# EasyEDA Pro project ZYNQ7020核心板-双DDR-V2.1.epro, board zynq核心板2312_2
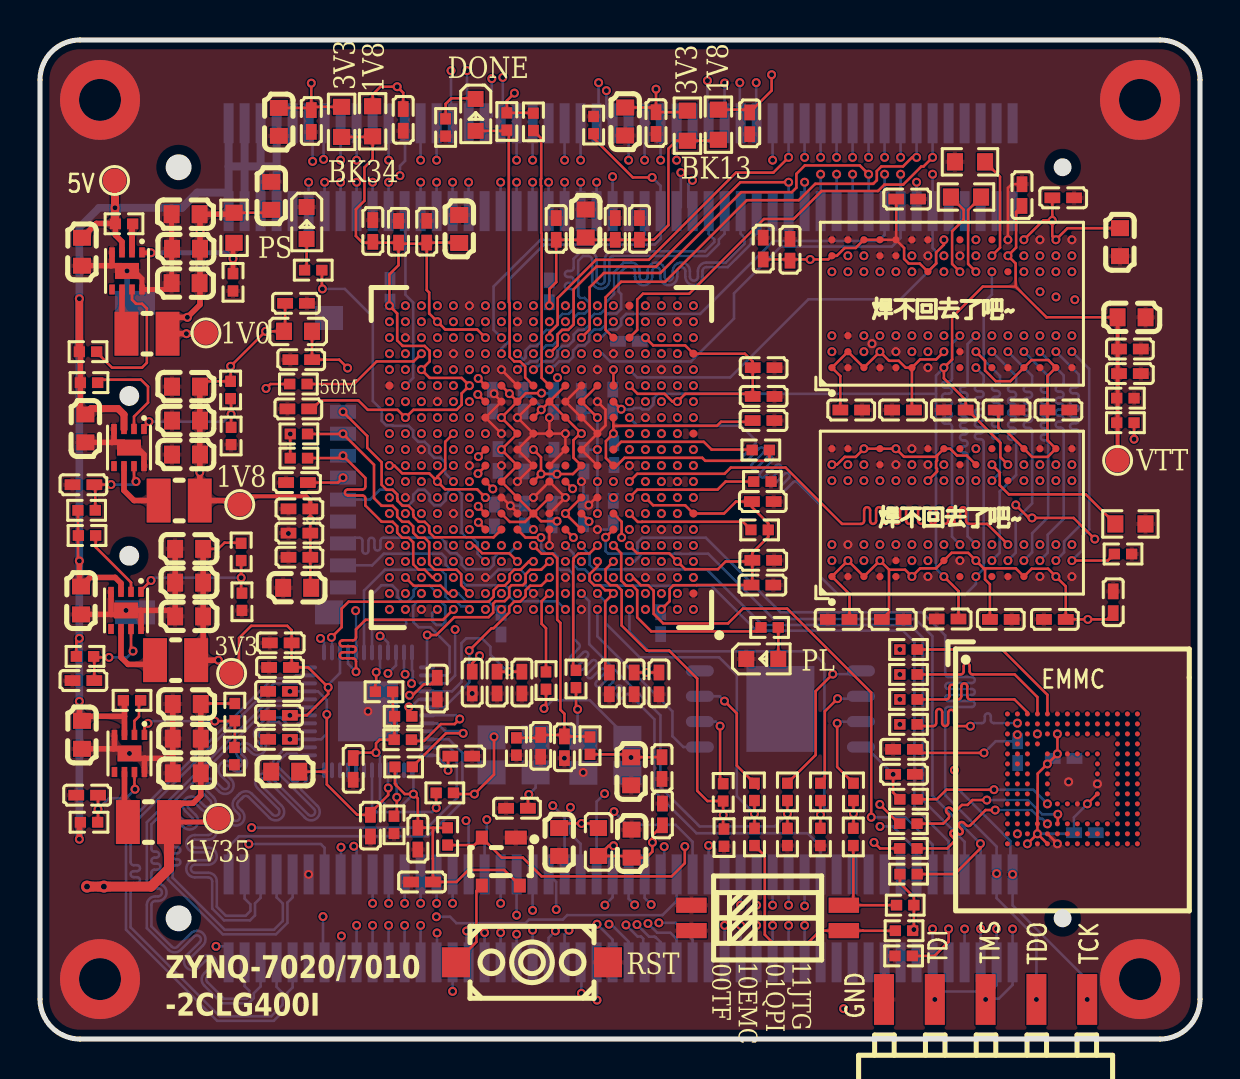
[diagram p10: board, top side]
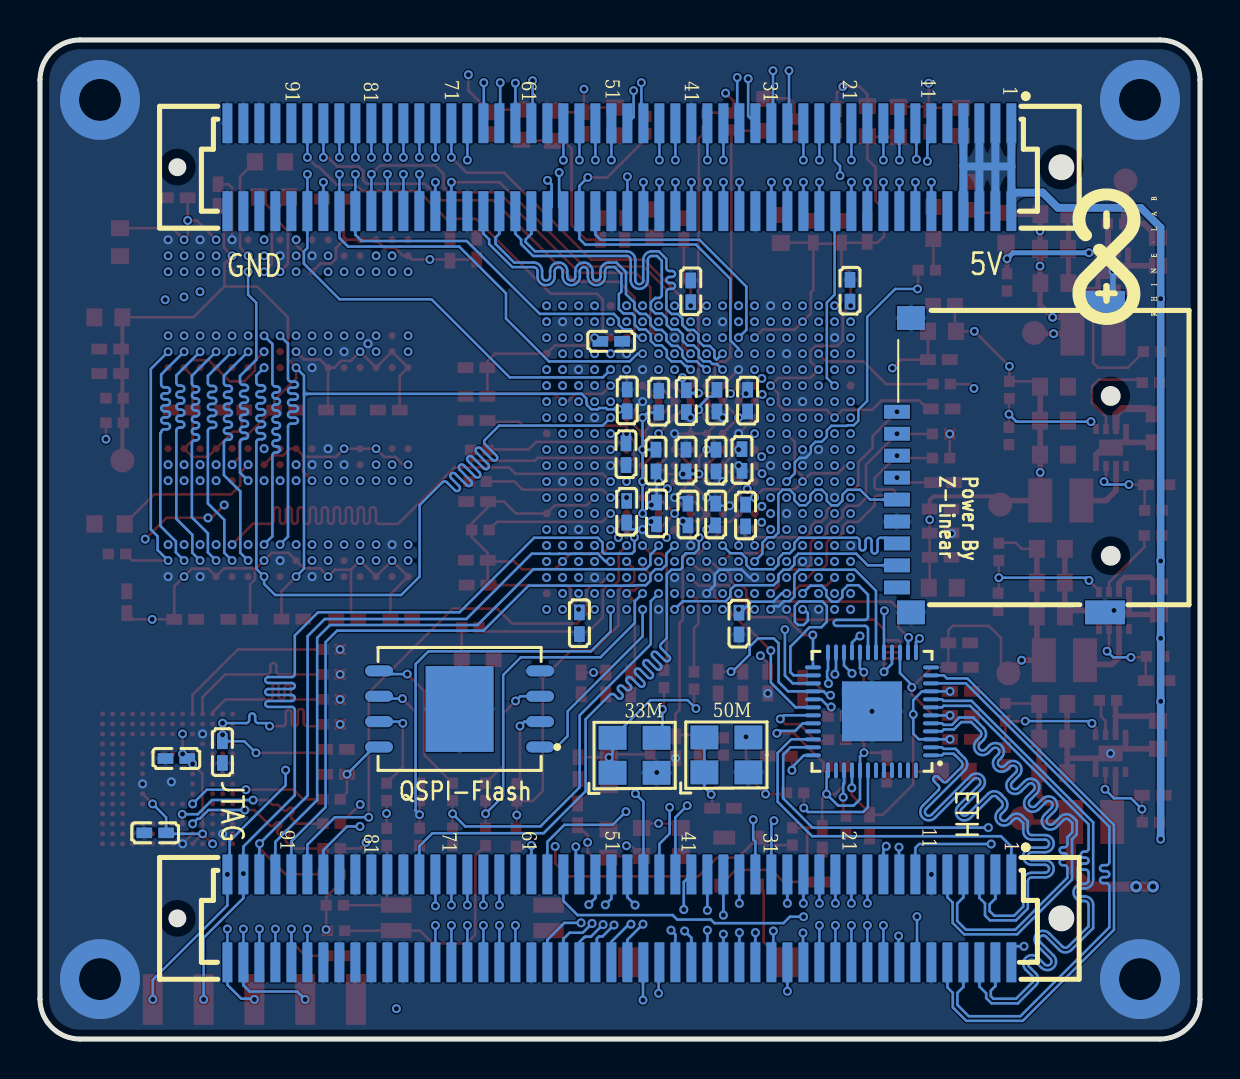
[diagram p11: board, bottom side, seen from below]

Outline 58 x 50 mm; copper layers: Top Layer, S1, S2, S3, S4, Bottom Layer. Coordinates in mm from the lower left corner of the outline.
Outline path: 0,48 0,2 arc(0.59,0.59) 2,0 56,0 arc(57.41,0.59) 58,2 58,48 arc(57.41,49.41) 56,50 2,50 arc(0.59,49.41) 0,48
Stack: Top Layer 0.035mm 外层铜厚1oz / Dielectric1 0.0994mm 3313 RC57% 4.2mil / S1 0.035mm / Dielectric2 0.55mm 0.55mm H/H No copper / S2 0.035mm / Dielectric3 0.1088mm 2116 RC54% 4.9mil / S3 0.035mm / Dielectric4 0.55mm 0.55mm H/H No copper / S4 0.035mm / Dielectric5 0.0994mm 3313 RC57% 4.2mil / Bottom Layer 0.035mm 外层铜厚1oz

## Design rules (mm)
net PHY_MDI3_N: PHY_MDI3
net PHY_MDI1_N: PHY_MDI1
net PHY_MDI3_P: PHY_MDI3
net PHY_MDI1_P: PHY_MDI1
net PHY_MDI2_N: PHY_MDI2
net PHY_MDI0_N: PHY_MDI0
net PHY_MDI2_P: PHY_MDI2
net PHY_MDI0_P: PHY_MDI0
net BK34_L1_N--T10: DP13
net BK34_L1_P--T11: DP13
net BK34_L2_P--T12: DP12
net BK34_L2_N--U12: DP12
net BK34_L6_P--P14: DP11
net BK34_L6_N--R14: DP11
net BK34_L4_P--V12: DP23
net BK34_L4_N--W13: DP23
net BK34_L8_P--W14: DP22
net BK34_L8_N--Y14: DP22
net BK34_L11_P--U14: DP9
net BK34_L10_P--V15: DP21
net BK34_L11_N--U15: DP9
net BK34_L10_N--W15: DP21
net BK34_L5_P--T14: DP8
net BK34_L18_P--V16: DP20
net BK34_L5_N--T15: DP8
net BK34_L18_N--W16: DP20
net BK34_L9_P--T16: DP6
net BK34_L9_N--U17: DP6
net BK34_L7_N--Y17: DP19
net BK34_L20_P--T17: DP7
net BK34_L7_P--Y16: DP19
net BK34_L20_N--R18: DP7
net BK34_L21_P--V17: DP18
net BK34_L21_N--V18: DP18
net BK34_L24_P--P15: DP5
net BK34_L17_P--Y18: DP17
net BK34_L24_N--P16: DP5
net BK34_L17_N--Y19: DP17
net BK34_L19_P--R16: DP4
net BK34_L22_P--W18: DP16
net BK34_L19_N--R17: DP4
net BK34_L22_N--W19: DP16
net BK34_L16_N--W20: DP15
net BK34_L23_N--P18: DP3
net BK34_L16_P--V20: DP15
net BK34_L23_P--N17: DP3
net BK34_L13_N--P19: DP24
net BK34_L13_P--N18: DP24
net BK34_L14_N--P20: DP1
net BK34_L15_P--T20: DP14
net BK34_L14_P--N20: DP1
net BK34_L15_N--U20: DP14
net DDR3_CLK_P: DDR3_CLK
net DDR3_CLK_N: DDR3_CLK
net DDR3_DQS0_P: DDR3_DQS0
net DDR3_DQS0_N: DDR3_DQS0
net DDR3_DQS1_N: DDR3_DQS1
net DDR3_DQS1_P: DDR3_DQS1
net DDR3_DQS2_P: DDR3_DQS2
net DDR3_DQS2_N: DDR3_DQS2
net DDR3_DQS3_N: DDR3_DQS3
net DDR3_DQS3_P: DDR3_DQS3
template: 用户自定义配置
spacing safeClearance (default): track to track 0.099, other pairs 0.099 to 0.3
track width trackWidth (default): min 0.13, default 0.13, max 1.001
differential pair differentialPair (default): width min 0.13, default 0.13, max 2.54; gap min 0.099, default 0.099
via viaSize (default): diameter min 0.45, default 0.45, max 10; hole min 0.201, default 0.201, max 5.999
net BK34_L1_N--T10 uses 数据等长
net BK34_L1_P--T11 uses 数据等长
net BK34_L2_P--T12 uses 数据等长
net BK34_L2_N--U12 uses 数据等长
net BK34_L6_P--P14 uses 数据等长
net BK34_L6_N--R14 uses 数据等长
net BK34_L4_P--V12 uses 数据等长
net BK34_L4_N--W13 uses 数据等长
net BK34_L8_P--W14 uses 数据等长
net BK34_L8_N--Y14 uses 数据等长
net BK34_L11_P--U14 uses 数据等长
net BK34_L10_P--V15 uses 数据等长
net BK34_L11_N--U15 uses 数据等长
net BK34_L10_N--W15 uses 数据等长
net BK34_L5_P--T14 uses 数据等长
net BK34_L18_P--V16 uses 数据等长
net BK34_L5_N--T15 uses 数据等长
net BK34_L18_N--W16 uses 数据等长
net BK34_L9_P--T16 uses 数据等长
net BK34_L9_N--U17 uses 数据等长
net BK34_L7_N--Y17 uses 数据等长
net BK34_L20_P--T17 uses 数据等长
net BK34_L7_P--Y16 uses 数据等长
net BK34_L20_N--R18 uses 数据等长
net BK34_L21_P--V17 uses 数据等长
net BK34_L21_N--V18 uses 数据等长
net BK34_L24_P--P15 uses 数据等长
net BK34_L17_P--Y18 uses 数据等长
net BK34_L24_N--P16 uses 数据等长
net BK34_L17_N--Y19 uses 数据等长
net BK34_L19_P--R16 uses 数据等长
net BK34_L22_P--W18 uses 数据等长
net BK34_L19_N--R17 uses 数据等长
net BK34_L22_N--W19 uses 数据等长
net BK34_L16_N--W20 uses 数据等长
net BK34_L23_N--P18 uses 数据等长
net BK34_L16_P--V20 uses 数据等长
net BK34_L23_P--N17 uses 数据等长
net BK34_L13_N--P19 uses 数据等长
net BK34_L13_P--N18 uses 数据等长
net BK34_L14_N--P20 uses 数据等长
net BK34_L15_P--T20 uses 数据等长
net BK34_L14_P--N20 uses 数据等长
net BK34_L15_N--U20 uses 数据等长
net DDR3_A0 uses 地址等长
net DDR3_A1 uses 地址等长
net DDR3_A2 uses 地址等长
net DDR3_A3 uses 地址等长
net DDR3_A4 uses 地址等长
net DDR3_A5 uses 地址等长
net DDR3_A6 uses 地址等长
net DDR3_A7 uses 地址等长
net DDR3_A8 uses 地址等长
net DDR3_A9 uses 地址等长
net DDR3_A10 uses 地址等长
net DDR3_A11 uses 地址等长
net DDR3_A12 uses 地址等长
net DDR3_A13 uses 地址等长
net DDR3_A14 uses 地址等长
net DDR3_BA0 uses 地址等长
net DDR3_BA1 uses 地址等长
net DDR3_BA2 uses 地址等长
net DDR3_CKE uses 地址等长
net DDR3_S0 uses 地址等长
net DDR3_RAS uses 地址等长
net DDR3_CAS uses 地址等长
net DDR3_WE uses 地址等长
net DDR3_ODT uses 地址等长
net DDR3_DM0 uses 数据等长
net DDR3_D2 uses 数据等长
net DDR3_D3 uses 数据等长
net DDR3_D6 uses 数据等长
net DDR3_D5 uses 数据等长
net DDR3_D7 uses 数据等长
net DDR3_DM1 uses 数据等长
net DDR3_D14 uses 数据等长
net DDR3_D15 uses 数据等长
net DDR3_D1 uses 数据等长
net DDR3_D0 uses 数据等长
net DDR3_D4 uses 数据等长
net DDR3_D8 uses 数据等长
net DDR3_D9 uses 数据等长
net DDR3_D10 uses 数据等长
net DDR3_D13 uses 数据等长
net DDR3_D11 uses 数据等长
net DDR3_D12 uses 数据等长
net DDR3_CLK_P uses ddr_clk
net DDR3_CLK_N uses ddr_clk
net DDR3_D18 uses 数据等长
net DDR3_D17 uses 数据等长
net DDR3_D16 uses 数据等长
net DDR3_D19 uses 数据等长
net DDR3_DM2 uses 数据等长
net DDR3_D20 uses 数据等长
net DDR3_D24 uses 数据等长
net DDR3_D26 uses 数据等长
net DDR3_DM3 uses 数据等长
net DDR3_D28 uses 数据等长
net DDR3_D25 uses 数据等长
net DDR3_D27 uses 数据等长
net DDR3_D29 uses 数据等长
net DDR3_D30 uses 数据等长
net DDR3_D31 uses 数据等长
net DDR3_D22 uses 数据等长
net DDR3_D23 uses 数据等长
net DDR3_D21 uses 数据等长
net DDR3_DQS0_P uses 数据等长
net DDR3_DQS0_N uses 数据等长
net DDR3_DQS1_N uses 数据等长
net DDR3_DQS1_P uses 数据等长
net DDR3_DQS2_P uses 数据等长
net DDR3_DQS2_N uses 数据等长
net DDR3_DQS3_N uses 数据等长
net DDR3_DQS3_P uses 数据等长

## Placement (name value [footprint] x y rotation side)
1V  -  [测试点]  8.3 35.34 0 top
1V8  -  [测试点]  9.99 26.75 0 top
1V35  -  [测试点]  8.92 11.04 180 top
3V3  -  [测试点]  9.58 18.3 0 top
5V  -  [测试点]  3.73 42.97 0 top
C1  22uF  [C0603]  7.28 41.28 0 top
C2  22uF  [C0603]  7.3 39.55 0 top
C3  22uF  [C0603]  7.28 37.83 0 top
C4  22uF  [C0603]  2.27 30.56 90 top
C5  22uF  [C0603]  7.3 32.65 0 top
C6  22uF  [C0603]  7.3 30.95 0 top
C7  22uF  [C0603]  7.3 29.25 0 top
C8  22uF  [C0603]  2.1 15.23 90 top
C9  22uF  [C0603]  7.34 16.77 0 top
C10  22uF  [C0603]  7.34 13.3 0 top
C11  22uF  [C0603]  7.34 15.03 0 top
C14  22uF  [C0603]  2.05 21.95 90 top
C15  22uF  [C0603]  7.46 24.53 0 top
C16  22uF  [C0603]  7.46 21.15 0 top
C17  22uF  [C0603]  7.46 22.84 0 top
C20  100nF  [C0402]  40.56 31.48 0 top
C22  100nF  [C0402]  43.15 31.48 180 top
C24  100nF  [C0402]  48.33 31.48 0 top
C26  100nF  [C0402]  50.92 31.48 0 top
C27  100nF  [C0402]  51.16 42.1 0 top
C28  100nF  [C0402]  37.5 39.5 90 top
C40  100nF  [C0402]  42.63 21 0 top
C42  100nF  [C0402]  53.66 21.86 90 top
C44  100nF  [C0402]  50.74 21 180 top
C45  100nF  [C0402]  43.36 42.04 0 top
C46  100nF  [C0402]  48.04 21 0 top
C47  100nF  [C0402]  36.16 39.56 90 top
C48  100nF  [C0402]  39.93 21 180 top
C65  100nF  [C0402]  25.03 14.67 270 top
C71  100nF  [C0402]  43.2 13.25 0 top
C74  100nF  [C0402]  45.38 21.02 180 top
C75  100nF  [C0402]  45.74 31.48 180 top
C76  100nF  [C0402]  49.1 42.24 90 top
C78  10uF  [C0402]  54.49 34.53 180 top
C79  100nF  [C0402]  31.12 11.24 90 top
C80  100nF  [C0402]  13.06 34 0 top
C81  100nF  [C0402_NEW]  27.17 26.31 270 bottom
C83  22uF  [C0603]  25.96 9.86 90 top
C84  100nF  [C0402_NEW]  25.81 40.54 90 top
C85  100nF  [C0402_NEW]  28.76 40.54 90 top
C86  100nF  [C0402_NEW]  25.46 37.42 90 bottom
C87  100nF  [C0402_NEW]  29.97 40.54 90 top
C89  100nF  [C0402]  16.52 10.68 270 top
C90  100nF  [C0402]  11.95 17.4 180 top
C91  100nF  [C0402]  28.46 17.8 90 top
C92  100nF  [C0402]  28.7 29.27 90 bottom
C93  100nF  [C0402]  26.22 14.6 270 top
C94  100nF  [C0402]  19.34 40.4 270 top
C95  100nF  [C0402]  19.1 7.86 0 top
C97  100nF  [C0402]  51.18 14.04 0 bottom
C99  100nF  [C0402]  52.24 10.32 0 bottom
C102  100nF  [C0402]  21.06 14.16 0 top
C104  100nF  [C0402_NEW]  17.93 40.4 90 top
C105  100nF  [C0402_NEW]  23.85 11.55 180 top
C106  22uF  [C0603]  2.1 39.4 90 top
C108  100nF  [C0402]  48.88 14.36 270 bottom
C109  1uF  [C0402]  43.2 14.5 0 top
C110  100nF  [C0402]  2.36 12.2 0 top
C111  10nF  [C0402]  2.17 27.74 0 top
C112  100nF  [C0402_NEW]  16.64 40.44 90 top
C113  100nF  [C0402]  11.95 15 180 top
C114  220nF  [C0402]  2.17 17.94 0 top
C115  10uF  [C0402]  54.49 33.3 180 top
C117  100nF  [C0402_NEW]  17.5 37.45 90 bottom
C118  100nF  [C0402_NEW]  12.91 31.53 180 top
C119  100nF  [c0402_new]  21.61 17.84 270 top
C120  100nF  [C0402_NEW]  12.85 27.85 180 top
C122  100nF  [C0402_NEW]  23.05 20.79 270 bottom
C123  100nF  [C0402_NEW]  31.1 13.56 270 top
C124  100nF  [C0402_NEW]  22.72 26.2 270 bottom
C130  100nF  [C0402_NEW]  29.44 34.92 180 bottom
C131  100nF  [C0402_NEW]  31.03 20.81 270 bottom
C132  100nF  [C0402_NEW]  36.12 22.72 0 top
C133  100nF  [C0402_NEW]  36.18 32.16 0 top
C134  100nF  [C0402_NEW]  36.18 33.6 0 top
C137  100nF  [C0402_NEW]  36.16 23.96 0 top
C140  100nF  [C0402_NEW]  36.14 26.9 0 top
C143  100nF  [C0402_NEW]  30.8 45.84 270 top
C144  100nF  [C0402_NEW]  28.66 26.39 270 bottom
C145  100nF  [C0402_NEW]  28.64 31.96 90 bottom
C146  1uF  [C0402]  13.56 45.94 90 top
C147  100nF  [C0402_NEW]  12.97 26.53 180 top
C148  100nF  [C0402_NEW]  12.8 36.82 0 top
C150  100nF  [C0402_NEW]  12.97 25.32 180 top
C157  22uF  [C0603]  27.28 40.81 270 top
C158  22uF  [C0603]  20.96 40.54 270 top
C159  22uF  [C0603]  29.56 13.4 90 top
C160  22uF  [C0603]  54 39.88 90 top
C161  22uF  [C0603]  11.94 45.9 90 top
C162  22uF  [C0603]  12.86 22.58 0 top
C163  22uF  [C0603]  54.58 36.12 180 top
C164  100nF  [C0402_NEW]  24.09 17.84 270 top
C165  100nF  [C0402_NEW]  22.62 31.95 90 bottom
C166  100nF  [C0402_NEW]  22.85 17.84 270 top
C167  100nF  [C0402_NEW]  27.2 28.95 270 bottom
C168  100nF  [C0402_NEW]  22.9 28.98 270 bottom
C169  100nF  [C0402_NEW]  27.06 31.9 90 bottom
C170  100nF  [C0402_NEW]  25.69 31.92 270 bottom
C171  100nF  [C0402_NEW]  30.95 17.8 270 top
C172  100nF  [C0402_NEW]  25.6 26.25 90 bottom
C173  100nF  [C0402_NEW]  29.71 17.8 270 top
C185  100nF  [C0402_NEW]  24.15 31.95 270 bottom
C186  100nF  [C0402_NEW]  25.7 28.95 90 bottom
C187  100nF  [C0402_NEW]  24.22 26.25 90 bottom
C188  100nF  [C0402_NEW]  24.2 28.95 270 bottom
C190  100nF  [C0402_NEW]  18.16 46 270 top
C192  100nF  [C0402_NEW]  35.48 45.83 270 top
C193  100nF  [C0402_NEW]  12.97 24.11 180 top
C205  22uF  [C0603]  29.58 9.78 270 top
C216  100nF  [C0402]  19.86 17.54 270 top
C218  22uF  [C0603]  12.26 13.38 0 top
C219  100nF  [C0402]  18.89 10.03 270 top
C220  100nF  [C0402]  12 18.6 180 top
C221  100nF  [C0402]  11.95 16.2 180 top
C223  22uF  [C0603]  29.26 45.92 90 top
C224  100nF  [C0402]  15.66 13.52 270 top
C225  100nF  [C0402]  12.03 19.82 180 top
C226  22uF  [C0603]  11.56 42.2 270 top
C227  1uF  [C0402]  36.18 30.95 180 top
CARD1  TF-01A  [TF-SMD_TF-01A]  9.95 29.1 90 bottom
CN1  BA41-A0BT-0-NHB  [CONN-SMD_FBB08006-F100S1013W5M]  29.03 6.04 0 bottom
CN2  BA41-A0BT-0-NHB  [CONN-SMD_FBB08006-F100S1013W5M]  29.03 43.63 0 bottom
FB1  GZ1608D601TF  [L0603]  12.9 35.42 180 top
FB2  GZ1608D601TF  [L0603]  27.92 9.86 270 top
H1  MH254RS-11-05-1000  [CONN-SMD_MH254RS-11-05-100]  47.28 1.98 180 top
L1  2.2uH  [IND-SMD_L2.5-W2.0]  6.96 26.95 180 top
L2  2.2uH  [IND-SMD_L2.5-W2.0]  5.42 10.86 180 top
L3  2.2uH  [IND-SMD_L2.5-W2.0]  6.78 18.96 180 top
L9  2.2uH  [IND-SMD_L2.5-W2.0]  5.35 35.3 180 top
LED1  19-217/GHC-YR1S2/3T  [LED0603-RD]  21.78 46.25 270 top
LED2  19-217/GHC-YR1S2/3T  [LED0603-RD]  13.33 40.84 270 top
LED3  19-217/GHC-YR1S2/3T  [LED0603-RD]  36.11 19.02 0 top
R1  10kΩ  [R0402]  2.45 32.85 180 top
R2  10kΩ  [R0402]  2.33 26.46 180 top
R3  10kΩ  [R0402]  2.4 34.4 180 top
R5  10kΩ  [R0402]  4.6 16.95 180 top
R6  10kΩ  [R0402]  2.45 10.85 180 top
R8  10kΩ  [R0402]  2.35 25.2 180 top
R9  10kΩ  [R0402]  2.25 19.15 180 top
R12  0402WGF330JTCE  [R0402]  43.42 18.25 180 top
R13  0402WGF330JTCE  [R0402]  43.42 19.49 180 top
R14  0402WGF330JTCE  [R0402]  43.42 15.75 180 top
R15  0402WGF330JTCE  [R0402]  43.42 10.78 180 top
R16  0402WGF330JTCE  [R0402]  43.42 12 180 top
R17  0402WGF330JTCE  [R0402]  43.42 9.54 180 top
R25  10kΩ  [R0402]  54.15 24.27 180 top
R26  10kΩ  [R0402]  54.27 32.07 180 top
R27  240Ω  [R0603_1]  54.52 25.78 0 top
R28  240Ω  [R0603_1]  46.5 43.9 180 top
R29  10kΩ  [R0402]  54.27 30.84 180 top
R55  4.7kΩ  [R0402]  36.04 29.48 0 top
R56  1kΩ  [R0402]  20.28 45.62 270 top
R57  0Ω  [R0603_1]  15.08 45.9 270 top
R58  NC  [R0603_1]  16.63 45.93 270 top
R59  4.7kΩ  [R0402]  18.18 13.62 180 top
R60  2.4kΩ  [R0402]  17.7 10.72 90 top
R61  4.7kΩ  [R0402]  17.2 17.38 180 top
R62  4.7kΩ  [R0402]  18.14 14.98 0 top
R63  0402WGF330JTCE  [R0402]  26.8 18.02 270 top
R64  4.7kΩ  [R0402]  18.16 16.15 0 top
R65  0402WGF330JTCE  [R0402]  39.02 12.37 90 top
R68  10kΩ  [R0402]  35.72 10.11 270 top
R69  10kΩ  [R0402]  40.66 10.11 270 top
R70  10kΩ  [R0402]  20.38 10.14 90 top
R71  10kΩ  [R0402]  25.3 17.94 270 top
R72  10kΩ  [R0402]  27.5 14.68 270 top
R73  10kΩ  [R0402]  23.82 14.64 90 top
R74  10kΩ  [R0402]  43.2 5.42 180 top
R75  10kΩ  [R0402]  43.26 6.7 180 top
R76  0402WGF330JTCE  [R0402]  37.37 12.37 90 top
R77  0402WGF330JTCE  [R0402]  34.16 12.34 90 top
R78  0402WGF330JTCE  [R0402]  35.72 12.37 90 top
R79  0402WGF330JTCE  [R0402]  40.67 12.37 90 top
R80  10kΩ  [R0402]  37.37 10.11 270 top
R81  10kΩ  [R0402]  34.2 10.08 270 top
R82  10kΩ  [R0402]  39.02 10.11 270 top
R83  10kΩ  [R0402]  43.18 4.16 180 top
R84  10kΩ  [R0402]  43.43 8.25 180 top
R85  0402WGF1000TCE  [R0402]  35.98 25.48 0 top
R86  0402WGF330JTCE  [R0402]  12.92 32.78 180 top
R87  4.7kΩ  [R0402]  27.68 45.74 90 top
R88  4.7kΩ  [R0402]  13.66 38.48 180 top
R89  4.7kΩ  [R0402]  36.48 20.6 0 top
R90  4.7kΩ  [R0402]  12.94 29.07 180 top
R92  4.7kΩ  [R0402]  12.94 30.28 180 top
R100  10kΩ  [R0402]  4.2 40.8 180 top
R106  0402WGF330JTCE  [R0402]  43.42 17 180 top
R109  82Ω  [R0603_1]  46.3 42.14 180 top
R110  4.7kΩ  [R0402]  24.67 45.9 90 top
R111  1kΩ  [R0402]  23.34 45.92 270 top
R115  0Ω  [R0603_1]  32.37 45.71 270 top
R118  NC  [R0603_1]  33.92 45.76 270 top
R119  0402WGF1000TCE  [R0402]  36.12 27.9 0 top
R122  0402WGF330JTCE  [R0402]  20.24 12.32 0 top
R123  10kΩ  [R0402]  9.65 37.87 90 top
R124  6.8kΩ  [R0603]  9.7 40.6 90 top
R125  10kΩ  [R0402]  10.06 24.38 270 top
R126  2.2kΩ  [R0402]  10.1 21.88 270 top
R127  20kΩ  [R0402]  9.53 32.48 90 top
R128  10kΩ  [R0402]  9.55 30.18 90 top
R131  12kΩ  [R0402_1]  9.72 14.16 270 top
R132  15kΩ  [R0402_1]  9.74 16.36 90 top
SW1  K2-1107ST-A4DW-06  [KEY-SMD_L6.2-W3.6-LS8.0]  24.6 3.84 180 top
SW3  DSHP02TSGET  [SW-SMD_4P_DSHP02TSGET]  36.38 6.06 270 top
U1  SY8003ADFC  [DFN-8_L2.0-W2.0-P0.50-LS2.0-BL-EP]  4.45 29.6 180 top
U2  SY8003ADFC  [DFN-8_L2.0-W2.0-P0.50-LS2.0-BL-EP]  4.47 14.29 180 top
U3  SY8003ADFC  [DFN-8_L2.0-W2.0-P0.50-LS2.0-BL-EP]  4.3 21.45 180 top
U6  NT5CC256M16ER-EK  [TFBGA-96_L13.0-W8.0-R16-C6-P0.80-TL]  45.59 26.34 90 top
U7  NT5CC256M16ER-EK  [TFBGA-96_L13.0-W8.0-R16-C6-P0.80-TL]  45.59 36.8 90 top
U12  XC7Z010-1CLG400C  [FBGA-400_L17.0-W17.0-R20-C20-P0.80-TL]  25.07 29.1 180 top
U17  RTL8211E-VB-CG  [QFN-48_L6.0-W6.0-P0.40-BL-EP3.8_WU]  16.4 16.4 90 bottom
U23  SY8003ADFC  [DFN-8_L2.0-W2.0-P0.50-LS2.0-BL-EP]  4.35 38.44 180 top
U25  W25Q256JVEIQ  [WSON-8_L8.0-W6.10-P1.27-BL-EP]  37.02 16.52 90 bottom
U27  KLM8G1GETF-B041  [emmc-153-deletePoint]  51.62 13.02 0 top
U29  HX811T  [SOT-143_L2.9-W1.3-P1.92-LS2.3-BL]  23.04 8.88 180 top
VRF1  -  [测试点]  53.88 28.96 0 top
X5  33.333MHz  [OSC-SMD_4P-L3.2-W2.5-BL]  28.27 14.2 180 bottom
X6  50MHz  [OSC-SMD_4P-L3.2-W2.5-BL]  23.68 14.22 180 bottom

## Footprints (pads in the part's own frame, mm; a bottom-side part is the same pattern mirrored in y, then rotated)
C0402
  rect 0.79x0.54 smd: 1(-0.545,0) 2(0.545,0)
c0402_new
  rect 0.79x0.54 smd: 1(-0.545,0) 2(0.545,0)
C0402_NEW
  rect 0.79x0.54 smd: 1(-0.545,0) 2(0.545,0)
C0603
  rect 0.8x0.9 smd: 1(-0.7,0) 2(0.7,0)
CONN-SMD_FBB08006-F100S1013W5M
  rect 0.5x2 smd: 1(-19.6,-2.2) 2(-19.6,2.2) 3(-18.8,-2.2) 4(-18.8,2.2) 5(-18,-2.2) 6(-18,2.2) 7(-17.2,-2.2) 8(-17.2,2.2) 9(-16.4,-2.2) 10(-16.4,2.2) 11(-15.6,-2.2) 12(-15.6,2.2) 13(-14.8,-2.2) 14(-14.8,2.2) 15(-14,-2.2) 16(-14,2.2) 17(-13.2,-2.2) 18(-13.2,2.2) 19(-12.4,-2.2) 20(-12.4,2.2) 21(-11.6,-2.2) 22(-11.6,2.2) 23(-10.8,-2.2) 24(-10.8,2.2) 25(-10,-2.2) 26(-10,2.2) 27(-9.2,-2.2) 28(-9.2,2.2) 29(-8.4,-2.2) 30(-8.4,2.2) 31(-7.6,-2.2) 32(-7.6,2.2) 33(-6.8,-2.2) 34(-6.8,2.2) 35(-6,-2.2) 36(-6,2.2) 37(-5.2,-2.2) 38(-5.2,2.2) 39(-4.4,-2.2) 40(-4.4,2.2) 41(-3.6,-2.2) 42(-3.6,2.2) 43(-2.8,-2.2) 44(-2.8,2.2) 45(-2,-2.2) 46(-2,2.2) 47(-1.2,-2.2) 48(-1.2,2.2) 49(-0.4,-2.2) 50(-0.4,2.2) 51(0.4,-2.2) 52(0.4,2.2) 53(1.2,-2.2) 54(1.2,2.2) 55(2,-2.2) 56(2,2.2) 57(2.8,-2.2) 58(2.8,2.2) 59(3.6,-2.2) 60(3.6,2.2) 61(4.4,-2.2) 62(4.4,2.2) 63(5.2,-2.2) 64(5.2,2.2) 65(6,-2.2) 66(6,2.2) 67(6.8,-2.2) 68(6.8,2.2) 69(7.6,-2.2) 70(7.6,2.2) 71(8.4,-2.2) 72(8.4,2.2) 73(9.2,-2.2) 74(9.2,2.2) 75(10,-2.2) 76(10,2.2) 77(10.8,-2.2) 78(10.8,2.2) 79(11.6,-2.2) 80(11.6,2.2) 81(12.4,-2.2) 82(12.4,2.2) 83(13.2,-2.2) 84(13.2,2.2) 85(14,-2.2) 86(14,2.2) 87(14.8,-2.2) 88(14.8,2.2) 89(15.6,-2.2) 90(15.6,2.2) 91(16.4,-2.2) 92(16.4,2.2) 93(17.2,-2.2) 94(17.2,2.2) 95(18,-2.2) 96(18,2.2) 97(18.8,-2.2) 98(18.8,2.2) 99(19.6,-2.2) 100(19.6,2.2)
CONN-SMD_MH254RS-11-05-100
  rect 1x2.54 smd: 1(-5.08,0) 2(-2.54,0) 3(0,0) 4(2.54,0) 5(5.08,0)
DFN-8_L2.0-W2.0-P0.50-LS2.0-BL-EP
  rect 0.28x0.505 smd: 1(-0.75,-0.927) 2(-0.25,-0.927) 3(0.25,-0.927) 4(0.75,-0.927) 5(0.75,0.927) 6(0.25,0.927) 7(-0.25,0.927) 8(-0.75,0.927)
  rect 1.2x0.8 smd: 9(0,0)
emmc-153-deletePoint
  round 0.25 smd: A1(-3.25,3.25) A2(-2.75,3.25) A3(-2.25,3.25) A4(-1.75,3.25) A5(-1.25,3.25) A6(-0.75,3.25) A7(-0.25,3.25) A8(0.25,3.25) A9(0.75,3.25) A10(1.25,3.25) A11(1.75,3.25) A12(2.25,3.25) A13(2.75,3.25) A14(3.25,3.25) B1(-3.25,2.75) B2(-2.75,2.75) B3(-2.25,2.75) B4(-1.75,2.75) B5(-1.25,2.75) B6(-0.75,2.75) B7(-0.25,2.75) B8(0.25,2.75) B9(0.75,2.75) B10(1.25,2.75) B11(1.75,2.75) B12(2.25,2.75) B13(2.75,2.75) B14(3.25,2.75) C1(-3.25,2.25) C2(-2.75,2.25) C3(-2.25,2.25) C4(-1.75,2.25) C5(-1.25,2.25) C6(-0.75,2.25) C7(-0.25,2.25) C8(0.25,2.25) C9(0.75,2.25) C10(1.25,2.25) C11(1.75,2.25) C12(2.25,2.25) C13(2.75,2.25) C14(3.25,2.25) D1(-3.25,1.75) D2(-2.75,1.75) D3(-2.25,1.75) D4(-1.75,1.75) D12(2.25,1.75) D13(2.75,1.75) D14(3.25,1.75) E1(-3.25,1.25) E2(-2.75,1.25) E3(-2.25,1.25) E5(-1.25,1.25) E6(-0.75,1.25) E7(-0.25,1.25) E8(0.25,1.25) E9(0.75,1.25) E10(1.25,1.25) E12(2.25,1.25) E13(2.75,1.25) E14(3.25,1.25) F1(-3.25,0.75) F2(-2.75,0.75) F3(-2.25,0.75) F5(-1.25,0.75) F10(1.25,0.75) F12(2.25,0.75) F13(2.75,0.75) F14(3.25,0.75) G1(-3.25,0.25) G2(-2.75,0.25) G3(-2.25,0.25) G5(-1.25,0.25) G10(1.25,0.25) G12(2.25,0.25) G13(2.75,0.25) G14(3.25,0.25) H1(-3.25,-0.25) H2(-2.75,-0.25) H3(-2.25,-0.25) H5(-1.25,-0.25) H10(1.25,-0.25) H12(2.25,-0.25) H13(2.75,-0.25) H14(3.25,-0.25) J1(-3.25,-0.75) J2(-2.75,-0.75) J3(-2.25,-0.75) J5(-1.25,-0.75) J10(1.25,-0.75) J12(2.25,-0.75) J13(2.75,-0.75) J14(3.25,-0.75) K1(-3.25,-1.25) K2(-2.75,-1.25) K3(-2.25,-1.25) K5(-1.25,-1.25) K6(-0.75,-1.25) K7(-0.25,-1.25) K8(0.25,-1.25) K9(0.75,-1.25) K10(1.25,-1.25) K12(2.25,-1.25) K13(2.75,-1.25) K14(3.25,-1.25) L1(-3.25,-1.75) L2(-2.75,-1.75) L3(-2.25,-1.75) L12(2.25,-1.75) L13(2.75,-1.75) L14(3.25,-1.75) M1(-3.25,-2.25) M2(-2.75,-2.25) M3(-2.25,-2.25) M4(-1.75,-2.25) M5(-1.25,-2.25) M6(-0.75,-2.25) M7(-0.25,-2.25) M8(0.25,-2.25) M9(0.75,-2.25) M10(1.25,-2.25) M11(1.75,-2.25) M12(2.25,-2.25) M13(2.75,-2.25) M14(3.25,-2.25) N1(-3.25,-2.75) N2(-2.75,-2.75) N3(-2.25,-2.75) N4(-1.75,-2.75) N5(-1.25,-2.75) N6(-0.75,-2.75) N7(-0.25,-2.75) N8(0.25,-2.75) N9(0.75,-2.75) N10(1.25,-2.75) N11(1.75,-2.75) N12(2.25,-2.75) N13(2.75,-2.75) N14(3.25,-2.75) P1(-3.25,-3.25) P2(-2.75,-3.25) P3(-2.25,-3.25) P4(-1.75,-3.25) P5(-1.25,-3.25) P6(-0.75,-3.25) P7(-0.25,-3.25) P8(0.25,-3.25) P9(0.75,-3.25) P10(1.25,-3.25) P11(1.75,-3.25) P12(2.25,-3.25) P13(2.75,-3.25) P14(3.25,-3.25)
FBGA-400_L17.0-W17.0-R20-C20-P0.80-TL
  round 0.4 smd: A1(-7.6,7.6) A2(-6.8,7.6) A3(-6,7.6) A4(-5.2,7.6) A5(-4.4,7.6) A6(-3.6,7.6) A7(-2.8,7.6) A8(-2,7.6) A9(-1.2,7.6) A10(-0.4,7.6) A11(0.4,7.6) A12(1.2,7.6) A13(2,7.6) A14(2.8,7.6) A15(3.6,7.6) A16(4.4,7.6) A17(5.2,7.6) A18(6,7.6) A19(6.8,7.6) A20(7.6,7.6) B1(-7.6,6.8) B2(-6.8,6.8) B3(-6,6.8) B4(-5.2,6.8) B5(-4.4,6.8) B6(-3.6,6.8) B7(-2.8,6.8) B8(-2,6.8) B9(-1.2,6.8) B10(-0.4,6.8) B11(0.4,6.8) B12(1.2,6.8) B13(2,6.8) B14(2.8,6.8) B15(3.6,6.8) B16(4.4,6.8) B17(5.2,6.8) B18(6,6.8) B19(6.8,6.8) B20(7.6,6.8) C1(-7.6,6) C2(-6.8,6) C3(-6,6) C4(-5.2,6) C5(-4.4,6) C6(-3.6,6) C7(-2.8,6) C8(-2,6) C9(-1.2,6) C10(-0.4,6) C11(0.4,6) C12(1.2,6) C13(2,6) C14(2.8,6) C15(3.6,6) C16(4.4,6) C17(5.2,6) C18(6,6) C19(6.8,6) C20(7.6,6) D1(-7.6,5.2) D2(-6.8,5.2) D3(-6,5.2) D4(-5.2,5.2) D5(-4.4,5.2) D6(-3.6,5.2) D7(-2.8,5.2) D8(-2,5.2) D9(-1.2,5.2) D10(-0.4,5.2) D11(0.4,5.2) D12(1.2,5.2) D13(2,5.2) D14(2.8,5.2) D15(3.6,5.2) D16(4.4,5.2) D17(5.2,5.2) D18(6,5.2) D19(6.8,5.2) D20(7.6,5.2) E1(-7.6,4.4) E2(-6.8,4.4) E3(-6,4.4) E4(-5.2,4.4) E5(-4.4,4.4) E6(-3.6,4.4) E7(-2.8,4.4) E8(-2,4.4) E9(-1.2,4.4) E10(-0.4,4.4) E11(0.4,4.4) E12(1.2,4.4) E13(2,4.4) E14(2.8,4.4) E15(3.6,4.4) E16(4.4,4.4) E17(5.2,4.4) E18(6,4.4) E19(6.8,4.4) E20(7.6,4.4) F1(-7.6,3.6) F2(-6.8,3.6) F3(-6,3.6) F4(-5.2,3.6) F5(-4.4,3.6) F6(-3.6,3.6) F7(-2.8,3.6) F8(-2,3.6) F9(-1.2,3.6) F10(-0.4,3.6) F11(0.4,3.6) F12(1.2,3.6) F13(2,3.6) F14(2.8,3.6) F15(3.6,3.6) F16(4.4,3.6) F17(5.2,3.6) F18(6,3.6) F19(6.8,3.6) F20(7.6,3.6) G1(-7.6,2.8) G2(-6.8,2.8) G3(-6,2.8) G4(-5.2,2.8) G5(-4.4,2.8) G6(-3.6,2.8) G7(-2.8,2.8) G8(-2,2.8) G9(-1.2,2.8) G10(-0.4,2.8) G11(0.4,2.8) G12(1.2,2.8) G13(2,2.8) G14(2.8,2.8) G15(3.6,2.8) G16(4.4,2.8) G17(5.2,2.8) G18(6,2.8) G19(6.8,2.8) G20(7.6,2.8) H1(-7.6,2) H2(-6.8,2) H3(-6,2) H4(-5.2,2) H5(-4.4,2) H6(-3.6,2) H7(-2.8,2) H8(-2,2) H9(-1.2,2) H10(-0.4,2) H11(0.4,2) H12(1.2,2) H13(2,2) H14(2.8,2) H15(3.6,2) H16(4.4,2) H17(5.2,2) H18(6,2) H19(6.8,2) H20(7.6,2) J1(-7.6,1.2) J2(-6.8,1.2) J3(-6,1.2) J4(-5.2,1.2) J5(-4.4,1.2) J6(-3.6,1.2) J7(-2.8,1.2) J8(-2,1.2) J9(-1.2,1.2) J10(-0.4,1.2) J11(0.4,1.2) J12(1.2,1.2) J13(2,1.2) J14(2.8,1.2) J15(3.6,1.2) J16(4.4,1.2) J17(5.2,1.2) J18(6,1.2) J19(6.8,1.2) J20(7.6,1.2) K1(-7.6,0.4) K2(-6.8,0.4) K3(-6,0.4) K4(-5.2,0.4) K5(-4.4,0.4) K6(-3.6,0.4) K7(-2.8,0.4) K8(-2,0.4) K9(-1.2,0.4) K10(-0.4,0.4) K11(0.4,0.4) K12(1.2,0.4) K13(2,0.4) K14(2.8,0.4) K15(3.6,0.4) K16(4.4,0.4) K17(5.2,0.4) K18(6,0.4) K19(6.8,0.4) K20(7.6,0.4) L1(-7.6,-0.4) L2(-6.8,-0.4) L3(-6,-0.4) L4(-5.2,-0.4) L5(-4.4,-0.4) L6(-3.6,-0.4) L7(-2.8,-0.4) L8(-2,-0.4) L9(-1.2,-0.4) L10(-0.4,-0.4) L11(0.4,-0.4) L12(1.2,-0.4) L13(2,-0.4) L14(2.8,-0.4) L15(3.6,-0.4) L16(4.4,-0.4) L17(5.2,-0.4) L18(6,-0.4) L19(6.8,-0.4) L20(7.6,-0.4) M1(-7.6,-1.2) M2(-6.8,-1.2) M3(-6,-1.2) M4(-5.2,-1.2) M5(-4.4,-1.2) M6(-3.6,-1.2) M7(-2.8,-1.2) M8(-2,-1.2) M9(-1.2,-1.2) M10(-0.4,-1.2) M11(0.4,-1.2) M12(1.2,-1.2) M13(2,-1.2) M14(2.8,-1.2) M15(3.6,-1.2) M16(4.4,-1.2) M17(5.2,-1.2) M18(6,-1.2) M19(6.8,-1.2) M20(7.6,-1.2) N1(-7.6,-2) N2(-6.8,-2) N3(-6,-2) N4(-5.2,-2) N5(-4.4,-2) N6(-3.6,-2) N7(-2.8,-2) N8(-2,-2) N9(-1.2,-2) N10(-0.4,-2) N11(0.4,-2) N12(1.2,-2) N13(2,-2) N14(2.8,-2) N15(3.6,-2) N16(4.4,-2) N17(5.2,-2) N18(6,-2) N19(6.8,-2) N20(7.6,-2) P1(-7.6,-2.8) P2(-6.8,-2.8) P3(-6,-2.8) P4(-5.2,-2.8) P5(-4.4,-2.8) P6(-3.6,-2.8) P7(-2.8,-2.8) P8(-2,-2.8) P9(-1.2,-2.8) P10(-0.4,-2.8) P11(0.4,-2.8) P12(1.2,-2.8) P13(2,-2.8) P14(2.8,-2.8) P15(3.6,-2.8) P16(4.4,-2.8) P17(5.2,-2.8) P18(6,-2.8) P19(6.8,-2.8) P20(7.6,-2.8) R1(-7.6,-3.6) R2(-6.8,-3.6) R3(-6,-3.6) R4(-5.2,-3.6) R5(-4.4,-3.6) R6(-3.6,-3.6) R7(-2.8,-3.6) R8(-2,-3.6) R9(-1.2,-3.6) R10(-0.4,-3.6) R11(0.4,-3.6) R12(1.2,-3.6) R13(2,-3.6) R14(2.8,-3.6) R15(3.6,-3.6) R16(4.4,-3.6) R17(5.2,-3.6) R18(6,-3.6) R19(6.8,-3.6) R20(7.6,-3.6) T1(-7.6,-4.4) T2(-6.8,-4.4) T3(-6,-4.4) T4(-5.2,-4.4) T5(-4.4,-4.4) T6(-3.6,-4.4) T7(-2.8,-4.4) T8(-2,-4.4) T9(-1.2,-4.4) T10(-0.4,-4.4) T11(0.4,-4.4) T12(1.2,-4.4) T13(2,-4.4) T14(2.8,-4.4) T15(3.6,-4.4) T16(4.4,-4.4) T17(5.2,-4.4) T18(6,-4.4) T19(6.8,-4.4) T20(7.6,-4.4) U1(-7.6,-5.2) U2(-6.8,-5.2) U3(-6,-5.2) U4(-5.2,-5.2) U5(-4.4,-5.2) U6(-3.6,-5.2) U7(-2.8,-5.2) U8(-2,-5.2) U9(-1.2,-5.2) U10(-0.4,-5.2) U11(0.4,-5.2) U12(1.2,-5.2) U13(2,-5.2) U14(2.8,-5.2) U15(3.6,-5.2) U16(4.4,-5.2) U17(5.2,-5.2) U18(6,-5.2) U19(6.8,-5.2) U20(7.6,-5.2) V1(-7.6,-6) V2(-6.8,-6) V3(-6,-6) V4(-5.2,-6) V5(-4.4,-6) V6(-3.6,-6) V7(-2.8,-6) V8(-2,-6) V9(-1.2,-6) V10(-0.4,-6) V11(0.4,-6) V12(1.2,-6) V13(2,-6) V14(2.8,-6) V15(3.6,-6) V16(4.4,-6) V17(5.2,-6) V18(6,-6) V19(6.8,-6) V20(7.6,-6) W1(-7.6,-6.8) W2(-6.8,-6.8) W3(-6,-6.8) W4(-5.2,-6.8) W5(-4.4,-6.8) W6(-3.6,-6.8) W7(-2.8,-6.8) W8(-2,-6.8) W9(-1.2,-6.8) W10(-0.4,-6.8) W11(0.4,-6.8) W12(1.2,-6.8) W13(2,-6.8) W14(2.8,-6.8) W15(3.6,-6.8) W16(4.4,-6.8) W17(5.2,-6.8) W18(6,-6.8) W19(6.8,-6.8) W20(7.6,-6.8) Y1(-7.6,-7.6) Y2(-6.8,-7.6) Y3(-6,-7.6) Y4(-5.2,-7.6) Y5(-4.4,-7.6) Y6(-3.6,-7.6) Y7(-2.8,-7.6) Y8(-2,-7.6) Y9(-1.2,-7.6) Y10(-0.4,-7.6) Y11(0.4,-7.6) Y12(1.2,-7.6) Y13(2,-7.6) Y14(2.8,-7.6) Y15(3.6,-7.6) Y16(4.4,-7.6) Y17(5.2,-7.6) Y18(6,-7.6) Y19(6.8,-7.6) Y20(7.6,-7.6)
IND-SMD_L2.5-W2.0
  rect 1.2x2.2 smd: 1(1.028,0) 2(-1.028,0)
KEY-SMD_L6.2-W3.6-LS8.0
  rect 1.4x1.5 smd: 1(-3.8,0) 2(3.8,0)
L0603
  rect 0.8x0.864 smd: 1(-0.7,0) 2(0.7,0)
LED0603-RD
  rect 0.8x0.8 smd: 1(-0.799,0) 2(0.799,0)
OSC-SMD_4P-L3.2-W2.5-BL
  rect 1.4x1.2 smd: 1(-1.1,-0.875) 2(1.1,-0.875) 3(1.1,0.875) 4(-1.1,0.875)
QFN-48_L6.0-W6.0-P0.40-BL-EP3.8_WU
  oval 0.2x0.8 smd: 1(-2.2,-2.95) 2(-1.8,-2.95) 3(-1.4,-2.95) 4(-1,-2.95) 5(-0.6,-2.95) 6(-0.2,-2.95) 7(0.2,-2.95) 8(0.6,-2.95) 9(1,-2.95) 10(1.4,-2.95) 11(1.8,-2.95) 12(2.2,-2.95) 25(2.2,2.95) 26(1.8,2.95) 27(1.4,2.95) 28(1,2.95) 29(0.6,2.95) 30(0.2,2.95) 31(-0.2,2.95) 32(-0.6,2.95) 33(-1,2.95) 34(-1.4,2.95) 35(-1.8,2.95) 36(-2.2,2.95)
  oval 0.8x0.2 smd: 13(2.95,-2.2) 14(2.95,-1.8) 15(2.95,-1.4) 16(2.95,-1) 17(2.95,-0.6) 18(2.95,-0.2) 19(2.95,0.2) 20(2.95,0.6) 21(2.95,1) 22(2.95,1.4) 23(2.95,1.8) 24(2.95,2.2) 37(-2.95,2.2) 38(-2.95,1.8) 39(-2.95,1.4) 40(-2.95,1) 41(-2.95,0.6) 42(-2.95,0.2) 43(-2.95,-0.2) 44(-2.95,-0.6) 45(-2.95,-1) 46(-2.95,-1.4) 47(-2.95,-1.8) 48(-2.95,-2.2)
  rect 3x3 smd: 49(0,0)
R0402
  rect 0.566x0.54 smd: 1(-0.433,0) 2(0.433,0)
R0402_1
  rect 0.566x0.54 smd: 1(-0.433,0) 2(0.433,0)
R0603
  rect 0.806x0.864 smd: 1(-0.753,0) 2(0.753,0)
R0603_1
  rect 0.806x0.864 smd: 1(-0.753,0) 2(0.753,0)
SOT-143_L2.9-W1.3-P1.92-LS2.3-BL
  rect 1.1x0.7 smd: 1(-0.75,-1.2)
  rect 0.6x0.7 smd: 2(0.95,-1.2) 3(0.95,1.2) 4(-0.95,1.2)
SW-SMD_4P_DSHP02TSGET
  rect 0.762x1.524 smd: 1(-0.635,-3.81) 2(0.635,-3.81) 3(0.635,3.81) 4(-0.635,3.81)
TF-SMD_TF-01A
  rect 0.7x1.3 smd: 1(2.292,5.2) 2(1.192,5.198) 3(0.096,5.2) 4(-1.004,5.2) 5(-2.103,5.2) 6(-3.201,5.2) 7(-4.298,5.2) 8(-5.396,5.2) 9(-6.5,5.2)
  rect 1.2x1.397 smd: 10(-7.747,4.502) 13(6.985,4.502)
  rect 1.2x2 smd: 11(-7.747,-5.2) 12(7.747,-5.2)
TFBGA-96_L13.0-W8.0-R16-C6-P0.80-TL
  round 0.36 smd: A1(-3.2,6) A2(-2.4,6) A3(-1.6,6) A7(1.6,6) A8(2.4,6) A9(3.2,6) B1(-3.2,5.2) B2(-2.4,5.2) B3(-1.6,5.2) B7(1.6,5.2) B8(2.4,5.2) B9(3.2,5.2) C1(-3.2,4.4) C2(-2.4,4.4) C3(-1.6,4.4) C7(1.6,4.4) C8(2.4,4.4) C9(3.2,4.4) D1(-3.2,3.6) D2(-2.4,3.6) D3(-1.6,3.6) D7(1.6,3.6) D8(2.4,3.6) D9(3.2,3.6) E1(-3.2,2.8) E2(-2.4,2.8) E3(-1.6,2.8) E7(1.6,2.8) E8(2.4,2.8) E9(3.2,2.8) F1(-3.2,2) F2(-2.4,2) F3(-1.6,2) F7(1.6,2) F8(2.4,2) F9(3.2,2) G1(-3.2,1.2) G2(-2.4,1.2) G3(-1.6,1.2) G7(1.6,1.2) G8(2.4,1.2) G9(3.2,1.2) H1(-3.2,0.4) H2(-2.4,0.4) H3(-1.6,0.4) H7(1.6,0.4) H8(2.4,0.4) H9(3.2,0.4) J1(-3.2,-0.4) J2(-2.4,-0.4) J3(-1.6,-0.4) J7(1.6,-0.4) J8(2.4,-0.4) J9(3.2,-0.4) K1(-3.2,-1.2) K2(-2.4,-1.2) K3(-1.6,-1.2) K7(1.6,-1.2) K8(2.4,-1.2) K9(3.2,-1.2) L1(-3.2,-2) L2(-2.4,-2) L3(-1.6,-2) L7(1.6,-2) L8(2.4,-2) L9(3.2,-2) M1(-3.2,-2.8) M2(-2.4,-2.8) M3(-1.6,-2.8) M7(1.6,-2.8) M8(2.4,-2.8) M9(3.2,-2.8) N1(-3.2,-3.6) N2(-2.4,-3.6) N3(-1.6,-3.6) N7(1.6,-3.6) N8(2.4,-3.6) N9(3.2,-3.6) P1(-3.2,-4.4) P2(-2.4,-4.4) P3(-1.6,-4.4) P7(1.6,-4.4) P8(2.4,-4.4) P9(3.2,-4.4) R1(-3.2,-5.2) R2(-2.4,-5.2) R3(-1.6,-5.2) R7(1.6,-5.2) R8(2.4,-5.2) R9(3.2,-5.2) T1(-3.2,-6) T2(-2.4,-6) T3(-1.6,-6) T7(1.6,-6) T8(2.4,-6) T9(3.2,-6)
WSON-8_L8.0-W6.10-P1.27-BL-EP
  oval 0.56x1.4 smd: 1(-1.905,-4.027) 2(-0.635,-4.027) 3(0.635,-4.027) 4(1.905,-4.027) 5(1.905,4.027) 6(0.635,4.027) 7(-0.635,4.027) 8(-1.905,4.027)
  rect 4.3x3.4 smd: 9(0,0)
测试点
  round 1.2 smd: 1(0,0)

## Nets
As in the schematic.

Pads without a net: CARD1 9; CN2 9 10 91 92; U1 5; U2 5; U3 5; U6 J1 J9 L1 L9 M7; U7 J1 J9 L1 L9 M7; U12 K9 L10; U17 12 33 43 44 45 46 48; U23 5; U27 A1 A2 A7 A8 A9 A10 A11 A12 A13 A14 B1 B3 B4 B5 B6 B7 B8 B9 B10 B11 B12 B13 B14 C1 C3 C5 C7 C8 C9 C10 C11 C12 C13 C14 D1 D2 D3 D4 D12 D13 D14 E1 E2 E3 E5 E8 E9 E10 E12 E13 E14 F1 F2 F3 F10 F12 F13 F14 G1 G2 G3 G10 G12 G13 G14 H1 H2 H3 H5 H12 H13 H14 J1 J2 J3 J12 J13 J14 K1 K2 K3 K6 K7 K10 K12 K13 K14 L1 L2 L3 L12 L13 L14 M1 M2 M3 M7 M8 M9 M10 M11 M12 M13 M14 N1 N3 N6 N7 N8 N9 N10 N11 N12 N13 N14 P1 P2 P7 P8 P9 P10 P11 P12 P13 P14

## Via types
v1: diameter 0.45, hole 0.25, Top Layer to Bottom Layer, 775 vias
v2: diameter 4, hole 2.1, Top Layer to Bottom Layer, 4 vias
v3: diameter 0.6, hole 0.3, Top Layer to Bottom Layer, 2 vias

## Routing (per net, layer and track width the routed paths; a pad name or vN(x,y) marks a point on that pad's centre or on a via; arc(x,y) is an arc through that point)
1V0: length 71.5
  Top Layer w0.13: C226.2 11.41,41.35 R124.2 ; C166.1 v1(23.45,18.38) C164.1 ; v1(25.08,32.32) 24.3,32.32 U12.P12 ; U12.P12 v1(23.07,31.1) U12.M12 v1(23.07,29.5) U12.K12 U12.J13 U12.H12 U12.G11 ; U12.P12 v1(23.47,32.3) U12.R13 ; C218.2 14.34,13.38 ; 14.34,13.38 14.34,12.74 15.86,11.22 C89.1 16.52,11.32 17.41,12.21 v1(17.41,12.57) ; 14.34,13.38 v1(14.34,16.25) ; C171.1 v1(30.32,18.34) C173.1 ; U12.G13 23.49,25.88 24.25,25.88 U12.G11 ; U12.G11 U12.H10 ; U12.G11 25.05,25.92 v1(25.85,25.92) ; U12.R7 U12.P8 v1(27.87,31.1) ; C102.1 20.4,14.05 v1(20.4,13.45) ; C216.1 19.53,17.76 19.19,17.76 18.63,17.2 v1(18.47,17.2)
  Top Layer w0.28: R124.2 9.63,41.28 C1.2 8,41.26 v1(8,40.44) C2.2 v1(8,38.68) 8,36.75 v1(7.37,36.12) 6.66,36.12 6.38,35.84 L9.2 v1(7.32,35.3) 8.26,35.3 1V.1
  S3 w0.13: v1(20.4,13.45) 19.84,12.88 17.72,12.88 v1(17.41,12.57)
  Bottom Layer w0.13: v1(27.87,29.5) v1(27.87,31.1) 27.62,31.35 C169.1 ; v1(27.87,29.5) v1(27.87,27.9) v1(27.87,26.3) ; v1(27.87,29.5) 27.87,29.49 C167.1 ; U17.36 19.8,14.2 20.4,13.6 v1(20.4,13.45) ; v1(12.5,15) U17.3 14.06,15 14.34,15.28 v1(14.34,16.25) 14.34,16.96 13.9,17.4 U17.9 v1(12.5,17.4) ; v1(25.08,32.32) 25.54,32.32 C170.1 25.88,32.66 v1(25.88,33.1) ; v1(17.41,12.57) 17.4,12.58 U17.40 ; v1(23.45,18.38) 23.38,18.38 22.52,19.24 22.52,19.63 22.1,20.05 21.31,20.05 21.07,19.81 21.07,17.87 20.6,17.4 U17.28 18.82,17.4 18.62,17.2 v1(18.47,17.2)
1V8: length 56.4
  Top Layer w0.13: C147.1 v1(13.52,25.99) C150.1 C193.1 13.52,22.63 C162.2 ; v1(36.58,48.26) 36.58,47.47 C192.1 35.34,46.51 R118.1 ; U12.P10 v1(25.06,31.49) U12.N11 ; U12.P10 U12.N9 v1(27.07,30.3) 27,30.3 26.68,29.97 26.68,29.09 U12.K8 26.65,28.27 v1(25.85,28.27) 25.84,28.28 v1(25.05,28.28) ; U12.P10 U12.R9 ; v1(48.79,26.73) 49.44,26.08 v1(49.6,26.08) 51.68,26.08 v1(52.74,25.02) ; R58.1 16.63,47.27 17.02,47.66 v1(17.86,47.66) 18.16,47.36 C190.1 ; v1(28.68,9.67) 28.43,9.67 FB2.2 29.5,9.16 C205.2 30.32,9.08 30.62,9.38 v1(30.62,9.84) 30.62,10.19 C79.1 ; U12.F8 v1(26.27,26.3) U12.H8 ; U12.J11 v1(25.05,28.28) ; v1(25.05,28.28) 25.05,29.12 v1(24.67,29.5) ; C5.2 8.27,32.92 R127.2 v1(9.53,33.67) v1(11.28,35.42) FB1.2 12.25,35.47 C148.1
  Top Layer w0.2: 1V8.1 10.4,27.16 13.32,27.16 13.52,26.96 C147.1
  Top Layer w0.28: C5.2 7.99,32.64 v1(7.99,28.36) L1.2 9.79,26.95 9.99,26.75
  Bottom Layer w0.13: C187.1 24.47,25.7 v1(24.67,25.5) ; v1(25.06,31.49) 25.06,31.64 24.55,32.15 24.35,32.15 24.15,32.35 C185.1 ; v1(24.67,29.5) 24.66,29.49 C188.1 ; v1(25.05,28.28) 25.58,28.28 C186.1
1V35: length 147.7
  Top Layer w0.13: 40.39,23.94 39.59,23.14 40.48,22.26 C48.1 ; v1(30.27,27.1) 30.66,26.71 32.26,26.71 U12.G1 34.2,26.3 34.8,26.9 C140.1 35.59,26.62 36.41,25.81 R85.2 36.41,25.13 35.62,24.33 C137.1 ; v1(49.19,40) 50.16,40.96 v1(50.62,40.96) ; U7.F1 43.28,33.6 42.94,33.94 42.45,33.94 v1(42,34.4) ; U7.F1 43.59,31.58 C22.1 ; U7.F1 44.01,34.01 44.81,34.01 v1(45.19,34.4) ; C27.1 v1(50.62,40.96) ; v1(50.62,40.96) 50.62,40.18 v1(50.79,40) 51.38,40.58 C160.2 ; 47.18,23.56 v1(46.79,23.94) ; 47.18,23.56 48.78,23.56 49.19,23.14 49.59,23.54 50.4,23.54 v1(50.79,23.14) 51.29,22.65 C44.1 v1(52.39,21) 53.35,21 C42.1 ; 47.18,23.56 47.25,23.49 47.25,23 47.49,22.76 C46.1 ; 40.39,34.4 U7.A1 40.02,33.18 C20.1 ; 46.79,23.94 46.41,24.33 45.58,24.33 44.81,23.56 44.01,23.56 v1(43.59,23.14) 43.25,23.49 42.45,23.49 ; 42.45,23.49 v1(42,23.94) 41.19,23.14 ; 42.45,23.49 42.45,21.36 C40.1 ; C47.1 v1(38.51,39.01) 39.41,39.01 U7.A8 39.84,39.2 40.23,39.59 40.78,39.59 41.19,40 U7.D9 42.79,40 42.81,40.02 C45.1 ; v1(46.79,34.4) 47.25,33.94 47.25,33.46 47.78,32.92 48.52,32.92 49.57,33.98 50.41,33.98 50.79,33.6 50.38,33.18 C26.1 50.38,29.96 50.79,29.54 50.38,29.13 49.61,29.13 49.19,29.54 48.34,30.4 48.1,30.4 47.91,30.58 47.91,31.35 C24.1 ; 41.99,34.4 41.19,33.6 U7.B2 ; R132.2 8.06,16.79 C9.2 ; v1(45.19,40) 45.19,39.75 44.81,39.36 44.81,38.81 U7.G7 43.98,38.81 43.43,38.81 43.21,39.04 43.21,39.59 U7.E9 ; v1(40.4,23.94) 41.19,23.14 ; 44.85,29.2 44.79,29.14 43.2,29.14 v1(42.79,29.54) U6.D9 v1(41.19,29.54) 40.78,29.13 40.23,29.13 39.84,28.74 v1(39.59,28.74) ; 44.85,29.2 44.85,28.95 44.81,28.91 44.81,28.58 44.85,28.54 44.85,28.4 v1(44.4,27.94) ; 44.85,29.2 45.19,29.54 45.51,29.54 45.85,29.2 46.34,29.2 46.79,28.74 ; C137.1 35.56,23.9 34.28,23.9 33.89,23.51 32.26,23.51 v1(31.87,23.9) 31.46,24.31 29.86,24.31 v1(29.47,24.7) ; C137.1 35.62,22.76 C132.1 32.84,22.72 32.83,22.71 31.67,22.71 31.48,22.52 31.48,21.91 v1(31.07,21.5) ; v1(29.47,32.7) 29.88,32.29 31.23,32.29 31.62,31.9 v1(31.87,31.9) 32.26,32.29 35.51,32.29 C133.1 C134.1 35.63,33.9 35.24,34.3 U12.U1 32.26,34.71 30.66,34.71 v1(30.27,35.1) ; R29.1 v1(54.7,30.02)
  Top Layer w0.25: L2.2 8.74,10.86 1V35.1
  Top Layer w0.28: L2.2 6.45,11.15 7.1,11.8 7.65,11.8 8.04,12.19 C10.2 C11.2 C9.2
  Top Layer w0.5: L2.2 6.45,8.53 5.55,7.63 v3(3.19,7.63) v3(2.35,7.63)
  S2 w0.13: v1(50.79,40) 50.41,39.61 50.41,37.81 v1(50,37.4) 50.26,37.14 v1(50.8,37.14) 51.6,37.14 v1(51.74,37)
  S4 w0.13: v1(31.07,29.5) 30.68,29.89 30.68,31.26 30.91,31.49 31.46,31.49 v1(31.87,31.9)
  vias: v1(40.18,1.52) v1(46.79,39.2)
3V3: length 151.4
  Top Layer w0.13: v1(21.98,19.18) 21.61,18.81 C119.1 ; 19.66,10.57 19.64,10.55 19.64,9.03 19.65,9.02 C95.2 20.82,7.86 21.42,8.46 23.21,8.46 U29.4 ; 19.66,10.57 C219.1 18.89,12.04 v1(18.67,12.26) 18.24,12.26 17.8,12.7 17.8,12.73 17.75,12.78 R59.2 ; 19.66,10.57 20.38,10.57 ; v1(20.67,30.3) 20.26,29.89 20.26,28.54 19.87,28.15 v1(19.87,27.9) ; v1(28.67,33.5) U12.R6 ; R62.1 16.98,14.98 16.8,14.8 v1(16.8,14.33) 15.93,14.33 C224.1 ; R71.2 25.3,16.64 v1(25.2,16.54) ; C91.2 28.26,18.55 28.26,21.89 v1(28.67,22.3) 28.51,22.46 28.26,22.46 28.01,22.71 27.71,22.71 27.48,22.94 27.48,23.26 27.87,23.65 v1(27.87,23.9) ; C143.1 30.56,46.62 C223.2 ; C143.1 32.29,46.38 R115.1 ; C143.1 v1(30.8,47.54) ; v1(19.87,27.9) 20.26,27.51 21.86,27.51 v1(22.27,27.1) ; v1(19.87,27.9) 19.46,28.31 18.11,28.31 17.72,28.7 v1(17.47,28.7) ; v1(12.51,30.28) R90.2 ; 24.61,46.39 24.57,46.35 23.34,46.35 23.34,46.96 v1(23.72,47.34) ; C146.2 13.46,46.6 C161.2 ; C146.2 13.73,46.65 R57.1 ; C146.2 v1(13.56,47.84) ; 17.64,16.25 17.64,17.37 R61.1 ; v1(20.67,22.3) 20.42,22.3 20.03,22.69 18.68,22.69 v1(18.27,23.1) ; v1(12.5,16.2) 13.34,16.2 14.41,17.27 v1(14.41,17.6) 13.41,18.6 C220.1 12.58,18.63 C225.1 12.58,20.46 12.36,20.68 10.56,20.68 9.95,20.07 9.95,18.67 3V3.1 ; v1(42.66,13.25) 42.66,12.34 R16.2 ; R64.1 17.73,15 ; v1(50.87,15.27) v1(50.87,14.27) v1(50.37,13.77) 49.89,13.29 49.87,10.71 ; 49.87,10.71 v1(49.87,10.27) ; 49.87,10.71 U27.M4 ; v1(49.87,10.27) v1(49.37,9.77) ; v1(49.87,10.27) U27.P5 ; v1(52.37,11.77) U27.J10 ; R72.2 29.39,14.25 v1(29.55,14.09) 29.56,14.1 C123.1 ; v1(15.15,28.1) 14.9,27.85 C120.1 ; 28.67,30.69 v1(28.67,30.3) 28.3,29.93 28.3,29.07 U12.K6 28.84,28.7 29.23,29.09 33.11,29.09 33.26,28.94 36.38,28.94 36.47,29.03 R55.2 ; 28.67,30.69 33.85,30.69 34.05,30.89 35.57,30.89 C227.2 ; 28.67,30.69 U12.N6 ; R74.1 v1(43.69,5.48) R75.1 43.69,7.11 42.99,7.81 R84.2 ; R125.1 10.03,24.84 9.22,24.84 8.91,24.53 C15.2 ; v1(21.47,24.7) 21.72,24.7 22.11,24.31 23.46,24.31 v1(23.87,23.9)
  Top Layer w0.28: 8.16,18.96 C16.2 C17.2 C15.2 ; 8.16,18.96 v1(8.92,18.96) 3V3.1 ; 8.16,18.96 L3.2
  S1 w0.13: v1(28.67,22.3) 28.67,22.48 28.28,22.87 28.28,23.49 v1(27.87,23.9) ; v1(23.07,21.5) 23.07,21.23 22.39,20.55 22.39,19.59 v1(21.98,19.18) ; v1(19.87,27.9) 19.87,27.65 19.48,27.26 19.48,26.94 19.71,26.71 19.71,26.69 19.48,26.46 19.48,25.98 19.25,25.76 19.25,25.68 v1(19.07,25.5)
  S3 w0.13: v1(17,20.17) 17,21.58 17.33,21.91 17.63,21.91 17.86,22.14 17.86,22.69 v1(18.27,23.1)
  S4 w0.13: v1(20.67,22.3) 20.26,22.71 20.26,24.04 20.51,24.29 20.88,24.29 21.29,24.7 v1(21.47,24.7)
  Bottom Layer w0.13: v1(25.2,16.54) 25.62,16.96 27.49,16.96 X5.4 29.37,14.27 v1(29.55,14.09) 29.37,13.91 X5.1 ; C122.1 23.05,21.32 23.02,21.29 22.43,21.89 21.33,21.89 20.92,22.3 v1(20.67,22.3) ; v1(16.8,14.33) 17,14.13 U17.41 17,12 17.32,11.68 18.09,11.68 v1(18.67,12.26) 18.67,13.38 U17.37 ; U17.6 v1(12.5,16.2) ; v1(49.87,10.27) 51.65,10.27 C99.1 51.69,11.09 v1(52.37,11.77) ; U17.15 15,18.32 14.41,17.73 v1(14.41,17.6) ; v1(28.67,30.3) 28.7,30.27 C92.2 ; U25.8 41.29,14.61 v1(42.66,13.25) ; v1(17,20.17) 17.07,20.17 17.4,19.84 U17.21
5V0: length 86.8
  Top Layer w0.13: R9.2 1.82,19.9 v1(1.97,20.05) ; v1(1.97,23.93) 1.9,24 R2.2
  Top Layer w0.28: R100.2 3.77,40.23 4.1,39.9 U23.3 ; v1(1.97,10) 1.97,10.8 R6.2 ; v1(1.97,23.93) 1.97,22.73 C14.2 2.5,23.1 3.76,23.1 4.05,22.81 U3.3 ; C4.2 2.02,31.51 R1.2 2.02,34.35 R3.2 ; R5.2 4.22,16.89 4.22,16.15 ; 3.75,40.82 2.82,40.82 C106.2 ; 4.22,16.15 U2.3 ; 4.22,16.15 2.33,16.15 C8.2 1.97,16.06 v1(1.97,16.9)
  Top Layer w0.355: C4.2 2.56,31.55 3.9,31.55 4.2,31.25 U1.3
  Top Layer w0.381: R3.2 v1(1.97,37.05)
  Top Layer w0.4: R100.2 3.75,40.82 v1(3.75,41.6) 3.75,42.6 3.73,42.62 5V.1
  Bottom Layer w0.381: v1(1.97,10) v1(1.97,16.9) v1(1.97,20.05) v1(1.97,23.93) v1(1.97,37.05) 1.97,40.62 2.95,41.6 v1(3.75,41.6)
  Bottom Layer w0.4: 9.43,43.67 10.23,43.67 ; 9.43,43.67 9.43,42.36 ; 9.43,43.67 CN2.1 ; 10.23,43.67 11.03,43.67 ; 10.23,43.67 CN2.3 ; 10.23,43.67 CN2.4 ; 11.83,43.7 CN2.8 ; 11.83,43.7 CN2.7 ; 11.83,43.7 11.8,43.67 11.03,43.67 ; 11.03,43.67 CN2.5 ; 11.03,43.67 CN2.6 ; 9.43,42.36 7.86,42.36 7.1,41.6 v1(3.75,41.6) ; 9.43,42.36 CN2.2
GND: length 80.5
  Top Layer w0.13: U12.K10 U12.L9 v1(26.27,30.3) U12.M10 ; U12.H7 27.81,27.1 v1(27.44,26.72) ; v1(27.87,31.9) 28.28,31.49 28.28,30.7 U12.M7 ; U12.M7 U12.L8 U12.K7 ; U12.M7 U12.N8 U12.P9 U12.R8 ; U12.M11 U12.M10 ; U12.M11 U12.L12 U12.K11 v1(23.87,27.9) ; U12.M11 v1(23.87,31.1) U12.P11 ; U12.M10 v1(25.47,31.1) ; v1(22.7,32.3) 22.7,32.27 U12.P13 U12.N14 v1(23.07,30.3) ; U12.G10 v1(26.27,27.1) U12.J10 v1(24.67,27.1) ; v1(23.07,33.5) U12.R12 ; C76.2 48.58,42.78 48.4,42.59 v1(48.4,40) ; U12.F10 v1(25.47,24.7) ; U12.H13 23.11,27.1 v1(23.52,26.69) 23.87,26.34 U12.G12 ; U27.N5 v1(50.87,9.77)
  Top Layer w0.25: C1.1 C3.1 6.26,37.51 U23.8 5.1,38.05 4.71,38.44 v1(4.35,38.44)
  Top Layer w0.28: 3.53,21.25 4.1,21.25 v1(4.3,21.45) 5.05,21.45 ; 3.53,21.25 C14.1 ; 3.53,21.25 3.55,21.27 U3.4 ; U1.4 3.7,29.96 3.6,29.86 ; C9.1 C11.1 6.64,14 ; 3.6,29.86 4.19,29.86 U1.9 4.85,29.6 5.2,29.25 U1.8 ; 3.6,29.86 C4.1 ; U3.8 5.05,21.45 ; 5.05,21.45 6.46,21.45 C16.1 C17.1 C15.1 ; 6.64,14 C10.1 ; 6.64,14 6.59,14.05 5.24,14.05 ; U2.8 5.22,14.03 5.24,14.05 ; 5.24,14.05 4.71,14.05 v1(4.47,14.29) 4.24,14.53 3.67,14.53 ; 3.54,38.7 4.09,38.7 v1(4.35,38.44) ; 3.54,38.7 3.6,38.76 U23.4 ; 3.54,38.7 C106.1 ; U2.4 3.72,14.57 3.67,14.53 ; 3.67,14.53 C8.1
  S1 w0.13: v1(31.07,25.5) 30.82,25.5 30.43,25.11 30.13,25.11 29.88,24.86 29.88,24.54 29.94,24.48 29.94,24.12 29.88,24.06 29.88,23.74 30.27,23.35 v1(30.27,23.1)
  S3 w0.13: v1(19.87,23.9) 19.46,23.49 19.46,21.89 v1(19.07,21.5)
  Bottom Layer w0.13: C81.1 27.17,27.8 v1(27.07,27.9) ; v1(27.87,25.5) 28.44,25.5 28.66,25.72 C144.2 ; C172.2 25.91,27.1 v1(26.27,27.1) ; v1(22.27,23.1) 22.52,23.1 22.92,23.5 23.47,23.5 23.48,23.49 24.03,23.49 24.26,23.26 24.26,22.71 v1(24.67,22.3) ; v1(23.52,26.69) 24.11,26.69 C187.2
  Bottom Layer w0.28: CARD1.12 4.35,37.25 v1(4.35,38.44)
  vias: v1(12.42,25.3) v1(13.43,8.24) v1(16.4,16.4) v1(17.47,24.7) v1(18.27,35.1) v1(18.27,27.1) v1(19.07,29.5) v1(19.87,31.9) v1(20.67,34.3) v1(20.67,26.3) v1(21.47,36.7) v1(21.47,28.7) v1(21.61,17.29) v1(23.07,28.7) v1(23.87,35.9) v1(26.27,35.1) v1(26.27,23.1) v1(26.22,14.05) v1(27.07,21.5) v1(27.16,13.34) v1(27.87,33.5) v1(28.67,34.3) v1(29.47,28.7) v1(30.27,31.1) v1(31.07,33.5) v1(31.87,35.9) v1(31.87,27.9) v1(40.4,24.74) v1(41.6,34.8) v1(42.79,34.4) v1(42.79,28.74) v1(43.59,29.54) v1(44.4,39.2) v1(44.4,33.6) v1(44.4,28.74) v1(44.4,23.14) v1(46,39.2) v1(46,23.94) v1(48.87,10.27) v1(49.87,15.27) v1(50,40) v1(50,23.14) v1(51.43,12.87) v1(51.59,40) v1(51.59,23.14) v1(52.87,12.77) v2(3,47) v2(3,3) v2(55,47) v2(55,3)
BK13_T5: length 22.4
  Bottom Layer w0.13: v1(44.63,43.28) CN2.90 44.63,39.59 44.81,39.41 44.81,38.81 43.02,37.02 38.42,37.02 34.51,33.11 29.86,33.11 v1(29.47,33.5)
BK13_T9: length 19.7
  S1 w0.13: v1(38.23,42.88) 38.23,42.11 35.5,39.38 28.78,39.38 26.68,37.28 26.68,33.91 v1(26.27,33.5)
  Bottom Layer w0.13: CN2.74 v1(38.23,42.88)
BK13_U5: length 21.5
  S1 w0.13: v1(43.83,42.88) 43.28,42.88 40.96,40.56 38.48,40.56 36.14,38.22 30.24,38.22 29.08,37.06 29.08,34.69 v1(29.47,34.3)
  Bottom Layer w0.13: CN2.88 v1(43.83,42.88)
BK13_U7: length 21.8
  Bottom Layer w0.13: v1(27.87,34.3) 28.12,34.3 28.51,33.91 32.55,33.91 34.7,36.06 34.7,37.32 37.04,39.66 42.6,39.66 43.03,40.09 CN2.86 v1(43.03,43.28)
BK13_U8: length 20
  S1 w0.13: v1(39.83,43.28) 39.83,42.61 38.37,41.15 37.81,41.15 35.72,39.06 29.68,39.06 27.46,36.84 27.46,34.69 v1(27.07,34.3)
  Bottom Layer w0.13: CN2.78 v1(39.83,43.28)
BK13_U9: length 21
  S1 w0.13: v1(39.03,43.28) 38.85,43.46 38.14,43.46 37.82,43.13 37.82,42.52 35.06,39.76 28.56,39.76 25.88,37.08 25.88,34.69 v1(26.27,34.3)
  Bottom Layer w0.13: CN2.76 v1(39.03,43.28)
BK13_U10: length 18.3
  Top Layer w0.13: v1(25.47,34.3) 25.88,34.71 25.88,35.26 26.11,35.49 26.41,35.49 26.68,35.76 26.68,37.52 27.82,38.66 30.8,38.66 35.02,42.88 v1(37.43,42.88)
  Bottom Layer w0.13: CN2.72 v1(37.43,42.88)
BK13_V5: length 21.5
  Top Layer w0.13: U12.V5 29.86,35.49 29.86,37.01 30.15,37.3 32.46,37.3 36.2,41.04 37.68,41.04 39.08,42.44 41.9,42.44 42.22,42.76 43.16,42.76 44.07,43.67 44.17,43.67 v1(44.63,44.12)
  Bottom Layer w0.13: CN2.89 v1(44.63,44.12)
BK13_V6: length 22.6
  Top Layer w0.13: U12.V6 28.28,35.49 28.28,37.12 29.06,37.9 31.26,37.9 35.34,41.98 37.94,41.98 38.76,42.8 41.66,42.8 41.84,42.98 41.84,43.44 42.07,43.67 43.15,43.67 43.6,44.12 v1(43.83,44.12)
  Bottom Layer w0.13: CN2.87 v1(43.83,44.12)
BK13_V7: length 19.7
  Bottom Layer w0.13: v1(27.87,35.1) 28.05,35.1 28.47,35.51 28.83,35.51 29.06,35.74 29.06,36.04 29.31,36.29 33.01,36.29 ; 33.01,36.29 36.66,39.94 41.92,39.94 42.23,40.25 CN2.84 v1(42.23,43.28)
BK13_V8: length 21.6
  Top Layer w0.13: v1(41.43,43.28) 40.99,43.72 38.24,43.72 37.82,43.3 37.82,42.61 37.59,42.38 35.06,42.38 31.02,38.34 28.2,38.34 27.48,37.62 27.48,35.51 v1(27.07,35.1)
  Bottom Layer w0.13: CN2.82 v1(41.43,43.28)
BK13_V10: length 18.3
  Top Layer w0.13: v1(37.43,44.12) 36.67,43.36 34.8,43.36 30.44,39 27.8,39 25.88,37.08 25.88,35.76 25.47,35.35 v1(25.47,35.1)
  Bottom Layer w0.13: CN2.71 v1(37.43,44.12)
BK13_V11: length 18.5
  S2 w0.13: v1(24.67,35.1) 25.08,35.51 25.08,36.06 25.31,36.29 25.37,36.29 25.39,36.31 25.63,36.31 25.86,36.54 25.86,37.26 31.08,42.48 35.52,42.48 36.63,43.59 v1(36.63,43.98)
  Bottom Layer w0.13: CN2.69 v1(36.63,43.98)
BK13_W6: length 21.2
  S1 w0.13: v1(43.03,44.12) 42.64,43.73 42.64,42.96 40.47,40.79 38.11,40.79 35.96,38.64 29.9,38.64 28.26,37 28.26,36.31 v1(28.67,35.9)
  Bottom Layer w0.13: CN2.85 v1(43.03,44.12)
BK13_W8: length 19.5
  S2 w0.13: v1(40.63,43.28) 39.71,42.36 38.2,42.36 37.2,41.36 31.38,41.36 28.28,38.26 28.28,36.56 28.03,36.31 27.56,36.31 27.33,36.08 27.25,36.08 v1(27.07,35.9)
  Bottom Layer w0.13: CN2.80 v1(40.63,43.28)
BK13_W9: length 19
  S2 w0.13: v1(39.03,44.12) 38.55,43.64 38.28,43.64 37.82,43.18 37.82,42.72 36.84,41.74 31.12,41.74 27.46,38.08 27.46,36.54 27.23,36.31 26.79,36.31 26.38,35.9 v1(26.27,35.9)
  Bottom Layer w0.13: CN2.75 v1(39.03,44.12)
BK13_W10: length 18.6
  S2 w0.13: v1(38.23,44.12) 37.57,43.46 37.38,43.46 36.04,42.12 31.1,42.12 26.68,37.7 26.68,36.54 26.45,36.31 25.96,36.31 25.73,36.08 25.65,36.08 v1(25.47,35.9)
  Bottom Layer w0.13: CN2.73 v1(38.23,44.12)
BK13_W11: length 19
  S2 w0.13: v1(34.23,47.84) 33.86,47.84 33.54,47.52 32.14,47.52 29.82,45.2 29.82,41.62 25.06,36.86 25.06,36.54 24.67,36.15 v1(24.67,35.9)
  Bottom Layer w0.13: CN2.63 v1(34.23,47.84)
BK13_Y6: length 19.1
  S3 w0.13: v1(28.67,36.7) 30.39,38.42 30.72,38.42 33.22,40.92 40.22,40.92 41.82,42.52 41.82,43.82 42.12,44.12 v1(42.23,44.12)
  Bottom Layer w0.13: CN2.83 v1(42.23,44.12)
BK13_Y7: length 19.2
  S3 w0.13: v1(27.87,36.7) 29.93,38.76 30.56,38.76 33.08,41.28 39.92,41.28 41.02,42.38 41.02,43.82 41.32,44.12 v1(41.43,44.12)
  Bottom Layer w0.13: CN2.81 v1(41.43,44.12)
BK13_Y8: length 19
  S3 w0.13: v1(27.07,36.7) 29.45,39.08 30.42,39.08 33,41.66 39.34,41.66 40.22,42.54 40.22,43.71 v1(40.63,44.12)
  Bottom Layer w0.13: CN2.79 v1(40.63,44.12)
BK13_Y9: length 19
  S3 w0.13: v1(26.27,36.7) 28.97,39.4 30.24,39.4 32.9,42.06 38.94,42.06 39.44,42.56 39.44,43.73 v1(39.83,44.12)
  Bottom Layer w0.13: CN2.77 v1(39.83,44.12)
BK13_Y11: length 18
  S2 w0.13: v1(24.67,36.7) 24.67,36.88 29.36,41.57 29.36,43.5 29.04,43.82 29.04,44.84 32.16,47.96 v1(33.37,47.96)
  Bottom Layer w0.13: CN2.61 33.37,45.89 v1(33.37,47.96)
BK13_Y12: length 19.9
  S4 w0.13: v1(23.87,36.7) 23.87,37.25 27.8,41.18 28.34,41.18 29.84,42.68 29.84,44.32 32.24,46.72 34.67,46.72 v1(35.81,47.86)
  Bottom Layer w0.13: v1(35.81,47.86) 35.81,45.85 CN2.67
BK13_Y13: length 20.6
  S4 w0.13: v1(23.07,36.7) 23.07,37.75 27.33,42.01 28.63,42.01 29.26,42.64 29.26,43.22 28.92,43.56 28.92,44.22 29.6,44.9 29.84,44.9 32.03,47.09 34.22,47.09 v1(34.99,47.86)
  Bottom Layer w0.13: CN2.65 34.99,45.87 v1(34.99,47.86)
BK34_IO_0--R19: length 9.1
  Bottom Layer w0.13: CN2.24 18.27,41.39 18.27,37.25 18.66,36.86 18.66,33.09 v1(18.27,32.7)
BK34_IO_25--T19: length 14.3
  S3 w0.13: v1(15.03,43.98) 14.62,43.57 14.62,37.15 17.08,34.69 17.08,34.14 17.31,33.91 17.86,33.91 v1(18.27,33.5)
  Bottom Layer w0.13: CN2.15 v1(15.03,43.98)
BK34_L1_N--T10: length 20.1
  Bottom Layer w0.13: v1(25.47,33.5) 25.65,33.68 25.73,33.68 25.96,33.91 26.43,33.91 26.66,34.14 26.66,34.46 26.91,34.71 27.23,34.71 27.46,34.94 27.46,35.26 27.71,35.51 28.03,35.51 28.26,35.74 28.26,36.17 28.4,36.31 28.83,36.31 29.06,36.54 29.06,37.28 28.93,37.41 28.93,38.29 29.27,38.63 29.55,38.63 arc(29.69,38.57) 29.75,38.43 29.75,38.15 arc(30.18,37.73) 30.61,38.15 30.61,38.43 arc(30.81,38.63) 31.01,38.43 31.01,38.15 arc(31.44,37.73) 31.87,38.15 31.87,38.43 arc(32.07,38.63) 32.27,38.43 32.27,38.15 arc(32.69,37.73) 33.12,38.15 33.12,38.43 arc(33.18,38.57) 33.32,38.63 34.38,38.63 35.54,39.79 35.54,40.02 35.83,40.3 CN2.68
BK34_L1_P--T11: length 20
  Bottom Layer w0.13: v1(24.67,33.5) 24.85,33.68 24.93,33.68 25.16,33.91 25.63,33.91 25.86,34.14 25.86,34.21 25.88,34.24 25.88,34.46 26.11,34.69 26.39,34.69 26.41,34.71 26.43,34.71 26.66,34.94 26.66,34.96 26.68,34.98 26.68,35.26 26.91,35.49 27.19,35.49 27.21,35.51 27.23,35.51 27.46,35.74 27.46,35.76 27.48,35.78 27.48,36.06 27.71,36.29 27.99,36.29 28.01,36.31 28.03,36.31 28.26,36.54 28.26,36.56 28.28,36.58 28.28,36.86 28.7,37.28 28.7,38.38 29.18,38.86 29.55,38.86 arc(29.85,38.73) 29.98,38.43 29.98,38.15 arc(30.18,37.95) 30.38,38.15 30.38,38.43 arc(30.81,38.86) 31.24,38.43 31.24,38.15 arc(31.44,37.95) 31.64,38.15 31.64,38.43 arc(32.07,38.86) 32.49,38.43 32.49,38.15 arc(32.69,37.95) 32.89,38.15 32.89,38.43 arc(33.02,38.73) 33.32,38.86 34.29,38.86 35.22,39.79 35.22,40.11 35.03,40.3 CN2.66
BK34_L2_N--U12: length 20.1
  Bottom Layer w0.13: v1(23.87,34.3) 24.16,34.01 24.19,34.01 24.29,34.11 24.29,34.13 24.28,34.14 24.28,34.46 24.51,34.69 24.83,34.69 25.08,34.94 25.08,35.26 25.31,35.49 25.63,35.49 25.88,35.74 25.88,36.06 26.11,36.29 26.43,36.29 26.68,36.54 26.68,37.39 arc(26.64,37.5) 26.53,37.54 26.39,37.54 arc(26.24,37.69) 26.39,37.84 26.53,37.84 arc(26.68,37.99) 26.53,38.14 26.39,38.14 arc(26.24,38.29) 26.39,38.44 26.53,38.44 arc(26.64,38.48) 26.68,38.59 26.68,39.04 27.06,39.42 27.41,39.42 arc(27.71,39.29) 27.84,38.99 27.84,37.97 arc(28.04,37.77) 28.24,37.97 28.24,38.99 arc(28.36,39.29) 28.66,39.42 33.25,39.42 33.72,39.89 33.72,40.02 33.43,40.3 CN2.62
BK34_L2_P--T12: length 20.1
  Bottom Layer w0.13: CN2.64 34.23,40.3 33.94,40.02 33.94,39.79 33.34,39.19 28.66,39.19 arc(28.52,39.13) 28.47,38.99 28.47,37.97 arc(28.04,37.55) 27.61,37.97 27.61,38.99 arc(27.55,39.13) 27.41,39.19 27.15,39.19 26.91,38.95 26.91,37.19 27.01,37.09 27.23,37.09 27.46,36.86 27.46,36.54 27.23,36.31 26.91,36.31 26.66,36.06 26.66,35.74 26.43,35.51 26.11,35.51 25.86,35.26 25.86,34.94 25.63,34.71 25.31,34.71 25.06,34.46 25.06,34.14 24.83,33.91 24.51,33.91 24.38,33.79 24.16,33.79 v1(23.87,33.5)
BK34_L4_N--W13: length 20
  S3 w0.13: v1(31.03,43.98) 31.16,43.98 31.24,43.9 31.24,42.72 30.3,41.78 28.98,41.78 28.74,41.54 arc(28.62,41.24) 28.74,40.93 28.91,40.76 arc(28.92,40.48) 28.63,40.48 28.46,40.65 arc(27.85,40.65) 27.85,40.04 28.03,39.87 arc(28.03,39.59) 27.74,39.59 27.57,39.76 arc(26.96,39.76) 26.96,39.15 27.14,38.98 arc(27.14,38.7) 26.85,38.7 26.63,38.92 arc(26.02,38.92) 26.02,38.32 26.13,38.21 arc(26.13,37.93) 25.84,37.93 25.79,37.98 arc(25.49,38.11) 25.18,37.98 24.26,37.06 24.26,35.74 24.03,35.51 23.46,35.51 v1(23.07,35.9)
  Bottom Layer w0.13: CN2.55 v1(31.03,43.98)
